# EAGLE schematic Proj_v22 (EAGLE 9.6.0)
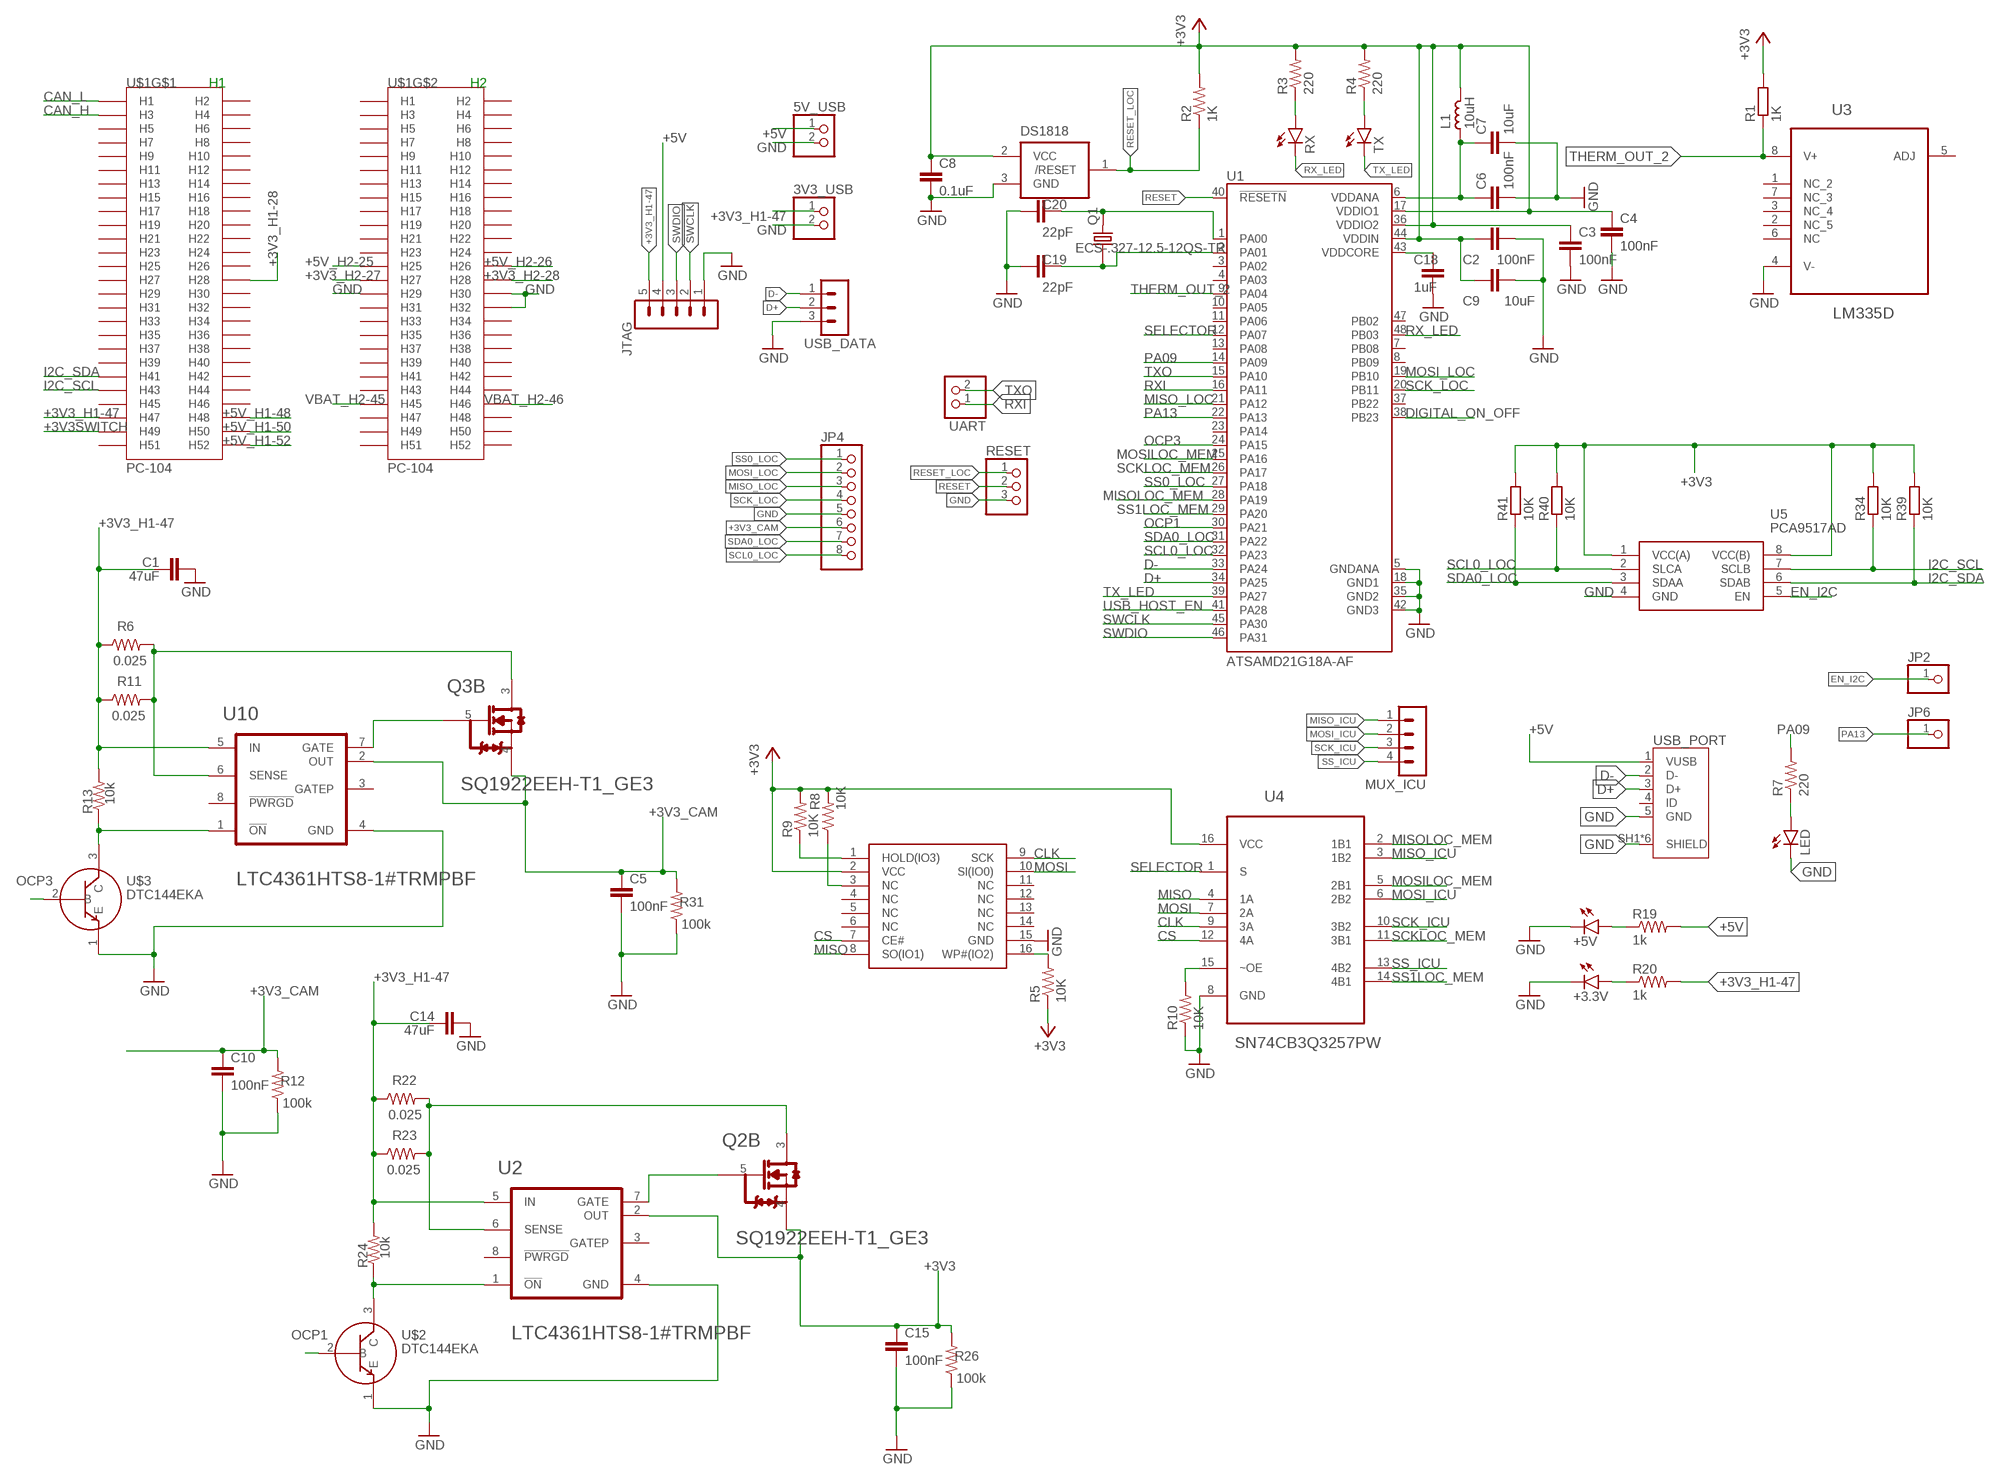
[diagram p0: schematic, sheet 1]

## Parts
3V3_USB  PINHD-1X2  [1X02]
5V_USB  PINHD-1X2  [1X02]
+3.3V  LEDCHIP-LED0805  [CHIP-LED0805]
+5V  LEDCHIP-LED0805  [CHIP-LED0805]
C1  47uF  C-EUC0805  [C0805]
C2  100nF  C-EUC0805K  [C0805K]
C3  100nF  C-EUC0805K  [C0805K]
C4  100nF  C-EUC0805K  [C0805K]
C5  100nF  C-EUC0805  [C0805]
C6  100nF  C-EUC0805K  [C0805K]
C7  10uF  C-EUC0805K  [C0805K]
C8  0.1uF  C-EUC0805K  [C0805K]
C9  10uF  C-EUC0805K  [C0805K]
C10  100nF  C-EUC0805  [C0805]
C14  47uF  C-EUC0805  [C0805]
C15  100nF  C-EUC0805  [C0805]
C18  1uF  C-EUC0805K  [C0805K]
C19  22pF  C-EUC0805K  [C0805K]
C20  22pF  C-EUC0805K  [C0805K]
JP2  PINHD-1X1  [1X01]
JP4  PINHD-1X8  [1X08]
JP6  PINHD-1X1  [1X01]
JTAG  MA05-1  [MA05-1]
L1  10uH  L_0805  [L0805]
LED  LEDCHIP-LED0805  [CHIP-LED0805]
LOC_MEM  SOIC127P600X175-16NSOIC-16YAS  [SOIC127P1032X265-17T480X861N]
MUX_ICU  MA04-1  [MA04-1]
Q1  ECS-.327-12.5-12QS-TR  [XTAL_ECS-.327-12.5-12QS-TR]
Q2  VISHAY_SQ1922EEH-T1_GE3VISHAY_SQ1922EEH-T1_GE3_0_0  [VISHAY_SQ1922EEH-T1_GE3_0]
Q3  VISHAY_SQ1922EEH-T1_GE3VISHAY_SQ1922EEH-T1_GE3_0_0  [VISHAY_SQ1922EEH-T1_GE3_0]
R1  1K  R-EU_M0805  [M0805]
R2  1K  R-US_M0805  [M0805]
R3  220  R-US_M0805  [M0805]
R4  220  R-US_M0805  [M0805]
R5  10K  R-US_M0805  [M0805]
R6  0.025  R-US_R0603  [R0603]
R7  220  R-US_M0805  [M0805]
R8  10K  R-US_M0805  [M0805]
R9  10K  R-US_M0805  [M0805]
R10  10K  R-US_M0805  [M0805]
R11  0.025  R-US_R0603  [R0603]
R12  100k  R-US_R0603  [R0603]
R13  10k  R-US_R0603  [R0603]
R19  1k  R-US_M0805  [M0805]
R20  1k  R-US_M0805  [M0805]
R22  0.025  R-US_R0603  [R0603]
R23  0.025  R-US_R0603  [R0603]
R24  10k  R-US_R0603  [R0603]
R26  100k  R-US_R0603  [R0603]
R31  100k  R-US_R0603  [R0603]
R34  10K  R-EU_M0805  [M0805]
R39  10K  R-EU_M0805  [M0805]
R40  10K  R-EU_M0805  [M0805]
R41  10K  R-EU_M0805  [M0805]
RESET  PINHD-1X3  [1X03]
RX  LEDCHIP-LED0805  [CHIP-LED0805]
TX  LEDCHIP-LED0805  [CHIP-LED0805]
U1  ATSAMD21G18A-AF  [QFP50P900X900X120-48N]
U2  LINEAR_TECHNOLOGY_LTC4361HTS8-1#TRMPBFLINEAR_TECHNOLOGY_LTC4361HTS8-1#TRMPBF_0_0  [LINEAR_TECHNOLOGY_LTC4361HTS8-1#TRMPBF_0]
U3  LM335D  [SOIC127P600X175-8N]
U4  SN74CB3Q3257PW  [SOP65P640X120-16N]
U5  PCA9517AD  [SOIC127P600X175-8N]
U10  LINEAR_TECHNOLOGY_LTC4361HTS8-1#TRMPBFLINEAR_TECHNOLOGY_LTC4361HTS8-1#TRMPBF_0_0  [LINEAR_TECHNOLOGY_LTC4361HTS8-1#TRMPBF_0]
U$1  PC-104  [PC-104]
U$2  DTC144EKA  [DTC144EKA]
U$3  DTC144EKA  [DTC144EKA]
U?2  DS1818  [SOT23]
UART  PINHD-1X2  [1X02]
USB_DATA  MA03-1  [MA03-1]
USB_PORT  10118192-0001LF  [AMPHENOL_10118192-0001LF]

## Nets
+3V3: C2.1 C3.1 C4.1 C8.1 C9.1 C15.1 L1.1 LOC_MEM.2(VCC) Q2.4(B:S2) R1.2 R2.2 R3.2 R4.2 R5.1 R8.2 R9.2 R26.2 R34.2 R39.2 R40.2 R41.2 U1.17(VDDIO1) U1.36(VDDIO2) U1.44(VDDIN) U2.2(OUT) U4.16(VCC) U5.1(VCC(A)) U5.8(VCC(B)) U?2.2(VCC)
+3V3_CAM: C5.1 C10.1 JP4.6 Q3.4(B:S2) R12.2 R31.2 U10.2(OUT)
+3V3_H1-28: U$1.P$28(H28)
+3V3_H1-47: 3V3_USB.1 C1.1 C14.1 JTAG.5 R6.1 R11.1 R13.2 R20.2 R22.1 R23.1 R24.2 U2.5(IN) U10.5(IN) U$1.P$47(H47)
+3V3_H2-27: U$1.P$79(H27)
+3V3_H2-28: U$1.P$80(H28)
+3V3SWITCH: U$1.P$49(H49)
+5V: 5V_USB.1 JTAG.4 R19.2 USB_PORT.1(VUSB)
+5V_H1-48: U$1.P$48(H48)
+5V_H1-50: U$1.P$50(H50)
+5V_H1-52: U$1.P$52(H52)
+5V_H2-25: U$1.P$77(H25)
+5V_H2-26: U$1.P$78(H26)
CAN_H: U$1.P$3(H3)
CAN_L: U$1.P$1(H1)
CLK: LOC_MEM.9(SCK) U4.9(3A)
CS: LOC_MEM.7(CE#) U4.12(4A)
D+: U1.34(PA25) USB_DATA.2 USB_PORT.3(D+)
D-: U1.33(PA24) USB_DATA.1 USB_PORT.2(D-)
DIGITAL_ON_OFF: U1.38(PB23)
EN_I2C: JP2.1 U5.5(EN)
GND [GND]: 3V3_USB.2 5V_USB.2 +3.3V.C +5V.C C1.2 C2.2 C3.2 C4.2 C5.2 C6.2 C7.2 C8.2 C9.2 C10.2 C14.2 C15.2 C18.2 C19.1 C20.1 JP4.5 JTAG.1 LED.C LOC_MEM.15(GND) R10.1 R12.1 R26.1 R31.1 RESET.3 U1.5(GNDANA) U1.18(GND1) U1.35(GND2) U1.42(GND3) U2.4(GND) U3.4(V-) U4.8(GND) U5.4(GND) U10.4(GND) U$1.P$81(H29) U$1.P$82(H30) U$1.P$84(H32) U$2.1(E) U$3.1(E) U?2.3(GND) USB_DATA.3 USB_PORT.5(GND) USB_PORT.SH1(SHIELD) USB_PORT.SH2(SHIELD) USB_PORT.SH3(SHIELD) USB_PORT.SH4(SHIELD) USB_PORT.SH5(SHIELD) USB_PORT.SH6(SHIELD)
I2C_SCL: R34.1 U5.7(SCLB) U$1.P$43(H43)
I2C_SDA: R39.1 U5.6(SDAB) U$1.P$41(H41)
ICU_OCP_SESNSE1: Q2.3(B:D2) R22.2 R23.2 U2.6(SENSE)
ICU_OCP_SESNSE3: Q3.3(B:D2) R6.2 R11.2 U10.6(SENSE)
MISO: LOC_MEM.8(SO(IO1)) U4.4(1A)
MISO_ICU: MUX_ICU.1 U4.3(1B2)
MISO_LOC: JP4.3 U1.21(PA12)
MISOLOC_MEM: U1.28(PA19) U4.2(1B1)
MOSI: LOC_MEM.10(SI(IO0)) U4.7(2A)
MOSI_ICU: MUX_ICU.2 U4.6(2B2)
MOSI_LOC: JP4.2 U1.19(PB10)
MOSILOC_MEM: U1.25(PA16) U4.5(2B1)
N$1: C20.2 Q1.2 U1.1(PA00)
N$2: LOC_MEM.16(WP#(IO2)) R5.2
N$3: LOC_MEM.1(HOLD(IO3)) R9.1
N$4: LOC_MEM.3(NC) R8.1
N$5: C6.1 C7.1 L1.2 U1.6(VDDANA)
N$6: +5V.A R19.1
N$7: R24.1 U2.1(!ON!) U$2.3(C)
N$8: +3.3V.A R20.1
N$9: R3.1 RX.A
N$10: C18.1 U1.43(VDDCORE)
N$11: C19.2 Q1.1 U1.2(PA01)
N$12: R4.1 TX.A
N$13: R13.1 U10.1(!ON!) U$3.3(C)
N$14: LED.A R7.1
N$15: Q3.5(B:G2) U10.7(GATE)
N$16: Q2.5(B:G2) U2.7(GATE)
N$31: R10.2 U4.15(~OE)
OCP1: U1.30(PA21) U$2.2(B)
OCP3: U1.24(PA15) U$3.2(B)
PA09: R7.2 U1.14(PA09)
PA13: JP6.1 U1.22(PA13)
RESET: RESET.2 U1.40(!RESETN)
RESET_LOC: R2.1 RESET.1 U?2.1(/RESET)
RX_LED: RX.C U1.48(PB03)
RXI: U1.16(PA11) UART.1
SCK_ICU: MUX_ICU.3 U4.10(3B2)
SCK_LOC: JP4.4 U1.20(PB11)
SCKLOC_MEM: U1.26(PA17) U4.11(3B1)
SCL0_LOC: JP4.8 R40.1 U1.32(PA23) U5.2(SLCA)
SDA0_LOC: JP4.7 R41.1 U1.31(PA22) U5.3(SDAA)
SELECTOR: U1.12(PA07) U4.1(S)
SS0_LOC: JP4.1 U1.27(PA18)
SS1LOC_MEM: U1.29(PA20) U4.14(4B1)
SS_ICU: MUX_ICU.4 U4.13(4B2)
SWCLK: JTAG.2 U1.45(PA30)
SWDIO: JTAG.3 U1.46(PA31)
THERM_OUT_2: R1.1 U1.9(PA04) U3.8(V+)
TX_LED: TX.C U1.39(PA27)
TXO: U1.15(PA10) UART.2
USB_HOST_EN: U1.41(PA28)
VBAT_H2-45: U$1.P$97(H45)
VBAT_H2-46: U$1.P$98(H46)
Unconnected: LOC_MEM.4(NC) LOC_MEM.5(NC) LOC_MEM.6(NC) LOC_MEM.11(NC) LOC_MEM.12(NC) LOC_MEM.13(NC) LOC_MEM.14(NC) Q2.1(A:S1) Q2.2(A:G1) Q2.6(A:D1) Q3.1(A:S1) Q3.2(A:G1) Q3.6(A:D1) U1.3(PA02) U1.4(PA03) U1.7(PB08) U1.8(PB09) U1.10(PA05) U1.11(PA06) U1.13(PA08) U1.23(PA14) U1.37(PB22) U1.47(PB02) U2.3(GATEP) U2.8(!PWRGD!) U3.1(NC_2) U3.2(NC_5) U3.3(NC_4) U3.5(ADJ) U3.6(NC) U3.7(NC_3) U10.3(GATEP) U10.8(!PWRGD!) U$1.P$2(H2) U$1.P$4(H4) U$1.P$5(H5) U$1.P$6(H6) U$1.P$7(H7) U$1.P$8(H8) U$1.P$9(H9) U$1.P$10(H10) U$1.P$11(H11) U$1.P$12(H12) U$1.P$13(H13) U$1.P$14(H14) U$1.P$15(H15) U$1.P$16(H16) U$1.P$17(H17) U$1.P$18(H18) U$1.P$19(H19) U$1.P$20(H20) U$1.P$21(H21) U$1.P$22(H22) U$1.P$23(H23) U$1.P$24(H24) U$1.P$25(H25) U$1.P$26(H26) U$1.P$27(H27) U$1.P$29(H29) U$1.P$30(H30) U$1.P$31(H31) U$1.P$32(H32) U$1.P$33(H33) U$1.P$34(H34) U$1.P$35(H35) U$1.P$36(H36) U$1.P$37(H37) U$1.P$38(H38) U$1.P$39(H39) U$1.P$40(H40) U$1.P$42(H42) U$1.P$44(H44) U$1.P$45(H45) U$1.P$46(H46) U$1.P$51(H51) U$1.P$53(H1) U$1.P$54(H2) U$1.P$55(H3) U$1.P$56(H4) U$1.P$57(H5) U$1.P$58(H6) U$1.P$59(H7) U$1.P$60(H8) U$1.P$61(H9) U$1.P$62(H10) U$1.P$63(H11) U$1.P$64(H12) U$1.P$65(H13) U$1.P$66(H14) U$1.P$67(H15) U$1.P$68(H16) U$1.P$69(H17) U$1.P$70(H18) U$1.P$71(H19) U$1.P$72(H20) U$1.P$73(H21) U$1.P$74(H22) U$1.P$75(H23) U$1.P$76(H24) U$1.P$83(H31) U$1.P$85(H33) U$1.P$86(H34) U$1.P$87(H35) U$1.P$88(H36) U$1.P$89(H37) U$1.P$90(H38) U$1.P$91(H39) U$1.P$92(H40) U$1.P$93(H41) U$1.P$94(H42) U$1.P$95(H43) U$1.P$96(H44) U$1.P$99(H47) U$1.P$100(H48) U$1.P$101(H49) U$1.P$102(H50) U$1.P$103(H51) U$1.P$104(H52) USB_PORT.4(ID)

## Notes on the sheet
- H1 | H2

## Library data of the parts
3V3_USB 5V_USB UART = pinhead:PINHD-1X2: PIN HEADER
+3.3V +5V LED RX TX = led:LED: LED OSRAM: - CHIPLED LG R971, LG N971, LY N971, LG Q971, LY Q971, LO R971, LY R971 LH N974, LH R974 LS Q976, LO Q976, LY Q976 LO Q996 - Hyper CHIPLED LW Q18S LB Q993, LB Q99A, LB R99A - SideLED LS A670, LO A670, LY A670, LG A670, LP A670 LB A673, LV A673, LT A673, LW A673 LH A674 LY A675 LS A676, LA A676, LO A676, LY A676, LW A676 LS A679, LY A679, LG A679 - Hyper Micro SIDELED® LS Y876, LA Y876, LO Y876, LY Y876 LT Y87S - SmartLED LW L88C, LW L88S LB L89C, LB L89S, LG L890 LS L89K, LO L89K, LY L89K LS L896, LA L896, LO L896, LY L896 - TOPLED LS T670, LO T670, LY T670, LG T670, LP T670 LSG T670, LSP T670, LSY T670, LOP T670, LYG T670 LG T671, LOG T671, LSG T671 LB T673, LV T673, LT T673, LW T673 LH T674 LS T676, LA T676, LO T676, LY T676, LB T676, LH T676, LSB T676, LW T676 LB T67C, LV T67C, LT T67C, LS T67K, LO T67K, LY T67K, LW E67C LS E67B, LA E67B, LO E67B, LY E67B, LB E67C, LV E67C, LT E67C LW T67C LS T679, LY T679, LG T679 LS T770, LO T770, LY T770, LG T770, LP T770 LB T773, LV T773, LT T773, LW T773 LH T774 LS E675, LA E675, LY E675, LS T675 LS T776, LA T776, LO T776, LY T776, LB T776 LHGB T686 LT T68C, LB T68C - Hyper Mini TOPLED® LB M676 - Mini TOPLED Santana® LG M470 LS M47K, LO M47K, LY M47K Source: http://www.osram.convergy.de LUXEON: - LUMILED® LXK2-PW12-R00, LXK2-PW12-S00, LXK2-PW14-U00, LXK2-PW14-V00 LXK2-PM12-R00, LXK2-PM12-S00, LXK2-PM14-U00 LXK2-PE12-Q00, LXK2-PE12-R00, LXK2-PE12-S00, LXK2-PE14-T00, LXK2-PE14-U00 LXK2-PB12-K00, LXK2-PB12-L00, LXK2-PB12-M00, LXK2-PB14-N00, LXK2-PB14-P00, LXK2-PB14-Q00 LXK2-PR12-L00, LXK2-PR12-M00, LXK2-PR14-Q00, LXK2-PR14-R00 LXK2-PD12-Q00, LXK2-PD12-R00, LXK2-PD12-S00 LXK2-PH12-R00, LXK2-PH12-S00 LXK2-PL12-P00, LXK2-PL12-Q00, LXK2-PL12-R00 Source: www.luxeon.com KINGBRIGHT: KA-3528ASYC Source: www.kingbright.com
C1-C10 C14 C15 C18-C20 = rcl:C-EU: CAPACITOR, European symbol; SPICEPREFIX: C
JP2 JP6 = adafruit:PINHD-1X1: Pin header 1x1 for 0.1" spacing With round pins
JP4 = pinhead:PINHD-1X8: PIN HEADER
JTAG = con-lstb:MA05-1: PIN HEADER; OC_FARNELL: unknown; OC_NEWARK: unknown
L1 = rc-master-smd:L_: INDUCTOR
LOC_MEM = SOIC127P600X175-16N_yas:SOIC127P600X175-16N
MUX_ICU = con-lstb:MA04-1: PIN HEADER; OC_FARNELL: unknown; OC_NEWARK: unknown
Q1 = ECS-.327-12.5-12QS-TR:ECS-.327-12.5-12QS-TR: SMD CRYSTAL 32.768 KHz; AVAILABILITY: Unavailable; DESCRIPTION: 32.768kHz ±20ppm Crystal 12.5pF 90 kOhms 2-SMD, No Lead; MF: ECS Inc.; MP: ECS-.327-12.5-12QS-TR; PACKAGE: SMD-2 ECS International; PRICE: None
Q2 Q3 = Vishay - SQ1922EEH-T1_GE3:VISHAY_SQ1922EEH-T1_GE3: MOSFET 2N-CH 20V SC70-6; AUTOMOTIVE: Yes; AUTOMOTIVE_GRADE: Grade 0; CENTROID_NOT_SPECIFIED: No; CONTINUOUS_DRAIN_CURRENT: 0.84A; DATASHEET: http://www.vishay.com/docs/75204/sq1922eeh.pdf; DEPLETION_MODE: False; DEVICE_CLASS_L1: Discrete Semiconductors; DEVICE_CLASS_L2: Transistors; DEVICE_CLASS_L3: MOSFETs; DIGIKEY_DESCRIPTION: TRANS MOSFET 2N-CH 20V SC70-6; DIGIKEY_PART_NUMBER: SQ1922EEH-T1_GE3CT-ND; DRAIN_TO_SOURCE_BREAKDOWN_VOLTAGE: 20V; DRAIN_TO_SOURCE_RESISTANCE: 0.2Ω; DRAIN_TO_SOURCE_VOLTAGE: 20V; FOOTPRINT_PARAMETERS_1: {"fp_type":"SOT3X3","params":{"N":{"default":"6","long name":"Number of leads","type":"multichoice","short name":"N"},"A":{"nom":false,"long name":"Height","min":900000,"max":1100000,"short name":"A","type":"measurement"},"A1":{"nom":false,"long name":"Standoff height","min":false,"max":100000,"short name":"A1","type":"measurement"},"A2":{"nom":false,"long name":"Package height","min":800000,"max":1000000,"short name":"A2","type":"measurement"},"D":{"nom":2000000,"long name":"Package length","min":1800000,"max":2200000,"short name":"D","type":"measurement"},"E":{"nom":2100000,"long name":"Width /w leads","min":1800000,"max":2400000,"short name":"E","type":"measurement"},"E1":{"nom":1250000,"long name":"Package width","min":1150000,"max":1350000,"short name":"E1","type":"measurement"},"B":{"nom":false,"long name":"Lead width","min":150000,"max":300000,"short name":"B","type":"measurement"},"C":{"nom":false,"long name":"Lead thickness","min":100000,"max":250000,"short name":"C","type":"measurement"},"L":{"nom":200000,"long name":"Lead foot length","min":100000,"max":300000,"short name":"L","type":"measurement"},"e":{"nom":650000,"long name":"Lead pitch","min":null,"max":null,"short name":"e","type":"measurement"},"PHI":{"nom":false,"long name":"Lead angle","min":0,"max":8,"short name":"PHI","type":"measurement"},"offset x":{"nom":0,"long name":"X Center offset","min":null,"max":null,"short name":"offset x","type":"measurement"},"offset y":{"nom":0,"long name":"Y Center offset","min":null,"max":null,"short name":"offset y","type":"measurement"},"LS":{"default":"Rounded rectangle","long name":"Land shape","type":"multichoice","short name":"LS"},"LS1":{"default":"Rectangle","long name":"Land shape (Pin 1)","type":"multichoice","short name":"LS1"},"solder toe":{"nom":550000,"long name":"Solder fillet (toe)","min":null,"max":null,"short name":"solder toe","type":"fixedmeasurement"},"solder heel":{"nom":250000,"long name":"Solder fillet (heel)","min":null,"max":null,"short name":"solder heel","type":"fixedmeasurement"},"solder side":{"nom":50000,"long name":"Solder fillet (side)","min":null,"max":null,"short name":"solder side","type":"fixedmeasurement"},"courtyard":{"nom":500000,"long name":"Courtyard","min":null,"max":null,"short name":"courtyard","type":"fixedmeasurement"},"SF":{"default":"A","long name":"Packing level","type":"multichoiceparent","short name":"SF","help":"http://support.upverter.com/customer/portal/articles/978783-what-is-a-footprint-packing-level","children":["solder toe","solder heel","solder side","courtyard"]}}}; FOOTPRINT_PARAMETERS_2: {"fp_type":"SOT3X3","params":{"N":{"default":"6","long name":"Number of leads","type":"multichoice","short name":"N"},"A":{"nom":false,"long name":"Height","min":900000,"max":1100000,"short name":"A","type":"measurement"},"A1":{"nom":false,"long name":"Standoff height","min":false,"max":100000,"short name":"A1","type":"measurement"},"A2":{"nom":false,"long name":"Package height","min":800000,"max":1000000,"short name":"A2","type":"measurement"},"D":{"nom":2000000,"long name":"Package length","min":1800000,"max":2200000,"short name":"D","type":"measurement"},"E":{"nom":2100000,"long name":"Width /w leads","min":1800000,"max":2400000,"short name":"E","type":"measurement"},"E1":{"nom":1250000,"long name":"Package width","min":1150000,"max":1350000,"short name":"E1","type":"measurement"},"B":{"nom":false,"long name":"Lead width","min":150000,"max":300000,"short name":"B","type":"measurement"},"C":{"nom":false,"long name":"Lead thickness","min":100000,"max":250000,"short name":"C","type":"measurement"},"L":{"nom":200000,"long name":"Lead foot length","min":100000,"max":300000,"short name":"L","type":"measurement"},"e":{"nom":650000,"long name":"Lead pitch","min":null,"max":null,"short name":"e","type":"measurement"},"PHI":{"nom":false,"long name":"Lead angle","min":0,"max":8,"short name":"PHI","type":"measurement"},"offset x":{"nom":0,"long name":"X Center offset","min":null,"max":null,"short name":"offset x","type":"measurement"},"offset y":{"nom":0,"long name":"Y Center offset","min":null,"max":null,"short name":"offset y","type":"measurement"},"LS":{"default":"Rounded rectangle","long name":"Land shape","type":"multichoice","short name":"LS"},"LS1":{"default":"Rectangle","long name":"Land shape (Pin 1)","type":"multichoice","short name":"LS1"},"solder toe":{"nom":350000,"long name":"Solder fillet (toe)","min":null,"max":null,"short name":"solder toe","type":"fixedmeasurement"},"solder heel":{"nom":150000,"long name":"Solder fillet (heel)","min":null,"max":null,"short name":"solder heel","type":"fixedmeasurement"},"solder side":{"nom":30000,"long name":"Solder fillet (side)","min":null,"max":null,"short name":"solder side","type":"fixedmeasurement"},"courtyard":{"nom":250000,"long name":"Courtyard","min":null,"max":null,"short name":"courtyard","type":"fixedmeasurement"},"SF":{"default":"B","long name":"Packing level","type":"multichoiceparent","short name":"SF","help":"http://support.upverter.com/customer/portal/articles/978783-what-is-a-footprint-packing-level","children":["solder toe","solder heel","solder side","courtyard"]}}}; FOOTPRINT_PARAMETERS_3: {"fp_type":"SOT3X3","params":{"N":{"default":"6","long name":"Number of leads","type":"multichoice","short name":"N"},"A":{"nom":false,"long name":"Height","min":900000,"max":1100000,"short name":"A","type":"measurement"},"A1":{"nom":false,"long name":"Standoff height","min":false,"max":100000,"short name":"A1","type":"measurement"},"A2":{"nom":false,"long name":"Package height","min":800000,"max":1000000,"short name":"A2","type":"measurement"},"D":{"nom":2000000,"long name":"Package length","min":1800000,"max":2200000,"short name":"D","type":"measurement"},"E":{"nom":2100000,"long name":"Width /w leads","min":1800000,"max":2400000,"short name":"E","type":"measurement"},"E1":{"nom":1250000,"long name":"Package width","min":1150000,"max":1350000,"short name":"E1","type":"measurement"},"B":{"nom":false,"long name":"Lead width","min":150000,"max":300000,"short name":"B","type":"measurement"},"C":{"nom":false,"long name":"Lead thickness","min":100000,"max":250000,"short name":"C","type":"measurement"},"L":{"nom":200000,"long name":"Lead foot length","min":100000,"max":300000,"short name":"L","type":"measurement"},"e":{"nom":650000,"long name":"Lead pitch","min":null,"max":null,"short name":"e","type":"measurement"},"PHI":{"nom":false,"long name":"Lead angle","min":0,"max":8,"short name":"PHI","type":"measurement"},"offset x":{"nom":0,"long name":"X Center offset","min":null,"max":null,"short name":"offset x","type":"measurement"},"offset y":{"nom":0,"long name":"Y Center offset","min":null,"max":null,"short name":"offset y","type":"measurement"},"LS":{"default":"Rounded rectangle","long name":"Land shape","type":"multichoice","short name":"LS"},"LS1":{"default":"Rectangle","long name":"Land shape (Pin 1)","type":"multichoice","short name":"LS1"},"solder toe":{"nom":150000,"long name":"Solder fillet (toe)","min":null,"max":null,"short name":"solder toe","type":"fixedmeasurement"},"solder heel":{"nom":50000,"long name":"Solder fillet (heel)","min":null,"max":null,"short name":"solder heel","type":"fixedmeasurement"},"solder side":{"nom":10000,"long name":"Solder fillet (side)","min":null,"max":null,"short name":"solder side","type":"fixedmeasurement"},"courtyard":{"nom":100000,"long name":"Courtyard","min":null,"max":null,"short name":"courtyard","type":"fixedmeasurement"},"SF":{"default":"C","long name":"Packing level","type":"multichoiceparent","short name":"SF","help":"http://support.upverter.com/customer/portal/articles/978783-what-is-a-footprint-packing-level","children":["solder toe","solder heel","solder side","courtyard"]}}}; FOOTPRINT_URL: http://www.vishay.com/docs/73242/si1411dh.pdf; FOOTPRINT_VARIANT_NAME_0: Recommended_Land_Pattern; FOOTPRINT_VARIANT_NAME_1: IPC_A; FOOTPRINT_VARIANT_NAME_2: IPC_B; FOOTPRINT_VARIANT_NAME_3: IPC_C; GATE_CHARGE_AT_VGS: 0.7nC @ 4.5V; GATE_TO_SOURCE_VOLTAGE: 12V; HEIGHT: 1.1mm; INPUT_CAPACITACE_AT_VDS: 50pF @ 10V; LEAD_FREE: Yes; MAX_FORWARD_DIODE_VOLTAGE: 1.2V; MAX_JUNCTION_TEMP: +175°C; MF: Vishay; MFG_PACKAGE_IDENT: S-03946; MFG_PACKAGE_IDENT_DATE: 07/2001; MFG_PACKAGE_IDENT_REV: B; MOUSER_DESCRIPTION: Transistor MOSFET Array Dual N 20V 0.84A 6-Pin SC-70; MOUSER_PART_NUMBER: 78-SQ1922EEH-T1_GE3; MPN: SQ1922EEH-T1_GE3; NUMBER_OF_CHANNELS: 2; NUMBER_OF_N_CHANNELS: 2; PACKAGE: SC70-6; POWER_DISSIPATION: 1.5W; PREFIX: Q; PULSE_DRAIN_CURRENT: 3A; ROHS: Yes; RTHJA_MAX: 460°C/W; TEMPERATURE_RANGE_HIGH: +175°C; TEMPERATURE_RANGE_LOW: -55°C; THRESHOLD_VGS_MAX: 1.5V; THRESHOLD_VGS_MIN: 0.5V; TURN_OFF_DELAY_TIME: 15ns; TURN_ON_DELAY_TIME: 10ns; TYP_FORWARD_DIODE_VOLTAGE: 0.8V; VERIFICATION_VERSION: 0.0.0.2
R1 R34 R39-R41 = rcl:R-EU_: RESISTOR, European symbol; SPICEPREFIX: R
R2-R5 R7-R10 R19 R20 = rcl:R-US_: RESISTOR, American symbol; SPICEPREFIX: R
R6 R11-R13 R22-R24 R26 R31 = adafruit:R-US_: RESISTOR, American symbol
RESET = pinhead:PINHD-1X3: PIN HEADER
U1 = ATSAMD21G18A-AF:ATSAMD21G18A-AF: Cortex-M0+, 256KB FLASH, 32KB SRAM, USB, DMA, T&R - 48TQFP IND TEMP, GREEN, 1.6-3.6V, 48MHz; AVAILABILITY: Unavailable; DESCRIPTION: ARM® Cortex®-M0+ Automotive, AEC-Q100, SAM D21G Microcontroller IC 32-Bit 48MHz 256KB (256K x 8) FLASH 48-TQFP (7x7); MF: Microchip; MP: ATSAMD21G18A-AF; PACKAGE: TQFP-48 Microchip; PRICE: None
U2 U10 = Linear Technology - LTC4361HTS8-1#TRMPBF:LINEAR_TECHNOLOGY_LTC4361HTS8-1#TRMPBF: LT-LTC4361-TS8-8; ACTIVE_LIMITING: no; CIIVA_IDS: 4748258; CIRCUIT_BREAKERS: 1; CIRCUIT_BREAKER_ACCURACY: 10; CIRCUIT_BREAKER_THRESHOLD: 50 mV; CODE__JEDEC: MO-193; COMPONENT_LINK_1_DESCRIPTION: Manufacturer URL; COMPONENT_LINK_1_URL: http://www.linear.com/; COMPONENT_LINK_3_DESCRIPTION: Package Specification; COMPONENT_LINK_3_URL: http://cds.linear.com/docs/en/packaging/SOT_8_05-08-1637.pdf; DATASHEET: http://cds.linear.com/docs/en/datasheet/436112fb.pdf; DATASHEET_VERSION: Rev. B; EXTENDED_TEMP: C, I, H; FAST_COMPARATOR: no; FAULT: no; FOLDBACK: no; FOOTPRINT_VARIANT_NAME_0: Manufacturer Recommended; IMPORTED: yes; IMPORTED_FROM: vault; IMPORT_TS: 1521868585; MF: Linear Technology; MOUNTING_TECHNOLOGY: Surface Mount; MPN: LTC4361HTS8-1#TRMPBF; PACKAGE: TS8-8; PACKAGE_DESCRIPTION: 8-Pin Plastic TSOT-23, Body 2.9 x 1.63 mm, Pitch 0.65 mm; PACKAGE_VERSION: Rev. A, 08/2010; PACKING: Mini Tape and Reel; POWER_GOOD: yes; PREFIX: U; RELEASE_DATE: 1377783499; RESET: no; ROHS: Yes; VAULT_GUID: 24CC4302-4FFA-4A70-800B-5B48980F788A; VAULT_REVISION: 1DDA1F1E-BD05-4D8F-94FE-36DD3E8B64DD; VIN_RANGE: 2.5 to 80 V
U3 = LM335D:LM335D: Precision temperature sensors; AVAILABILITY: Unavailable; DESCRIPTION: Temperature Sensor Analog, Local -40°C ~ 100°C 10mV/°C 8-SO; MF: STMicroelectronics; MP: LM335D; PACKAGE: SOIC-8 STMicroelectronics; PRICE: None
U4 = SN74CB3Q3257PW:SN74CB3Q3257PW: 4-BIT 1-OF-2 FET MULTIPLEXER/DEMULTIPLEXER; AVAILABILITY: Unavailable; DESCRIPTION: 4-Bit One-of-2 FET Multiplexer/Demultiplexer 2.5-V/3.3-V Low-Voltage, High-Bandwidth Bus Switch 16-TSSOP -40 to 85; MF: Texas Instruments; MP: SN74CB3Q3257PW; PACKAGE: TSSOP-16 Texas Instruments; PRICE: None
U5 = PCA9517AD:PCA9517AD: NXP PCA9517AD, 2-channel I/O Expander 400kHz, I2C, 8-Pin SOIC Source: Datasheet <https://datasheet.datasheetarchive.com/originals/distributors/SFDatasheet-4/sf-00081881.pdf>; DESCRIPTION: NXP PCA9517AD, 2-channel I/O Expander 400kHz, I2C, 8-Pin SOIC; HEIGHT: 1.75mm; MANUFACTURER_NAME: Nexperia; MANUFACTURER_PART_NUMBER: PCA9517AD; MOUSER_PART_NUMBER: 771-PCA9517AD; MOUSER_PRICE-STOCK: https://www.mouser.com/Search/Refine.aspx?Keyword=771-PCA9517AD
U$1 = Locana Board:PC-104
U$2 U$3 = DTC144EKA:DTC144EKA
U?2 = newchips:DS1818: 3.3V EconoReset with pushbutton
USB_DATA = con-lstb:MA03-1: PIN HEADER; OC_FARNELL: unknown; OC_NEWARK: unknown
USB_PORT = microUSB:10118192-0001LF: Single Port 5 Contact Horizontal Right Angle Shielded Micro B USB 2.0 Connector; AVAILABILITY: Unavailable; DESCRIPTION: USB - micro B USB 2.0 Receptacle Connector 5 Position Surface Mount, Right Angle; MF: Amphenol ICC; MP: 10118192-0001LF; PACKAGE: None; PRICE: None

## Net classes
0 default: width 0.203 mm
1 GND: width 0.254 mm